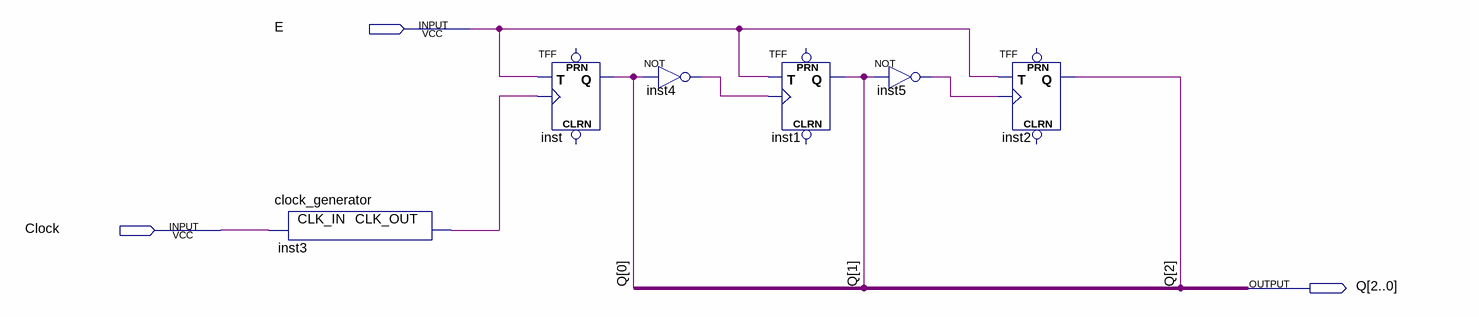
[diagram p0: schematic sheet]
// Quartus schematic Up_counter_3b.bdf as structural Verilog: 6 symbols, 3 pins
module Up_counter_3b (
  input  E,
  input  Clock,
  output [2:0] Q
);

  wire inst3_clk_out, inst4_out, inst5_out;

  clock_generator inst3 (.CLK_IN(Clock), .CLK_OUT(inst3_clk_out));
  TFF inst (.T(E), .CLK(inst3_clk_out), .Q(Q[0]));  // open: PRN, CLRN
  not inst4 (inst4_out, Q[0]);
  TFF inst1 (.T(E), .CLK(inst4_out), .Q(Q[1]));  // open: PRN, CLRN
  not inst5 (inst5_out, Q[1]);
  TFF inst2 (.T(E), .CLK(inst5_out), .Q(Q[2]));  // open: PRN, CLRN
endmodule
